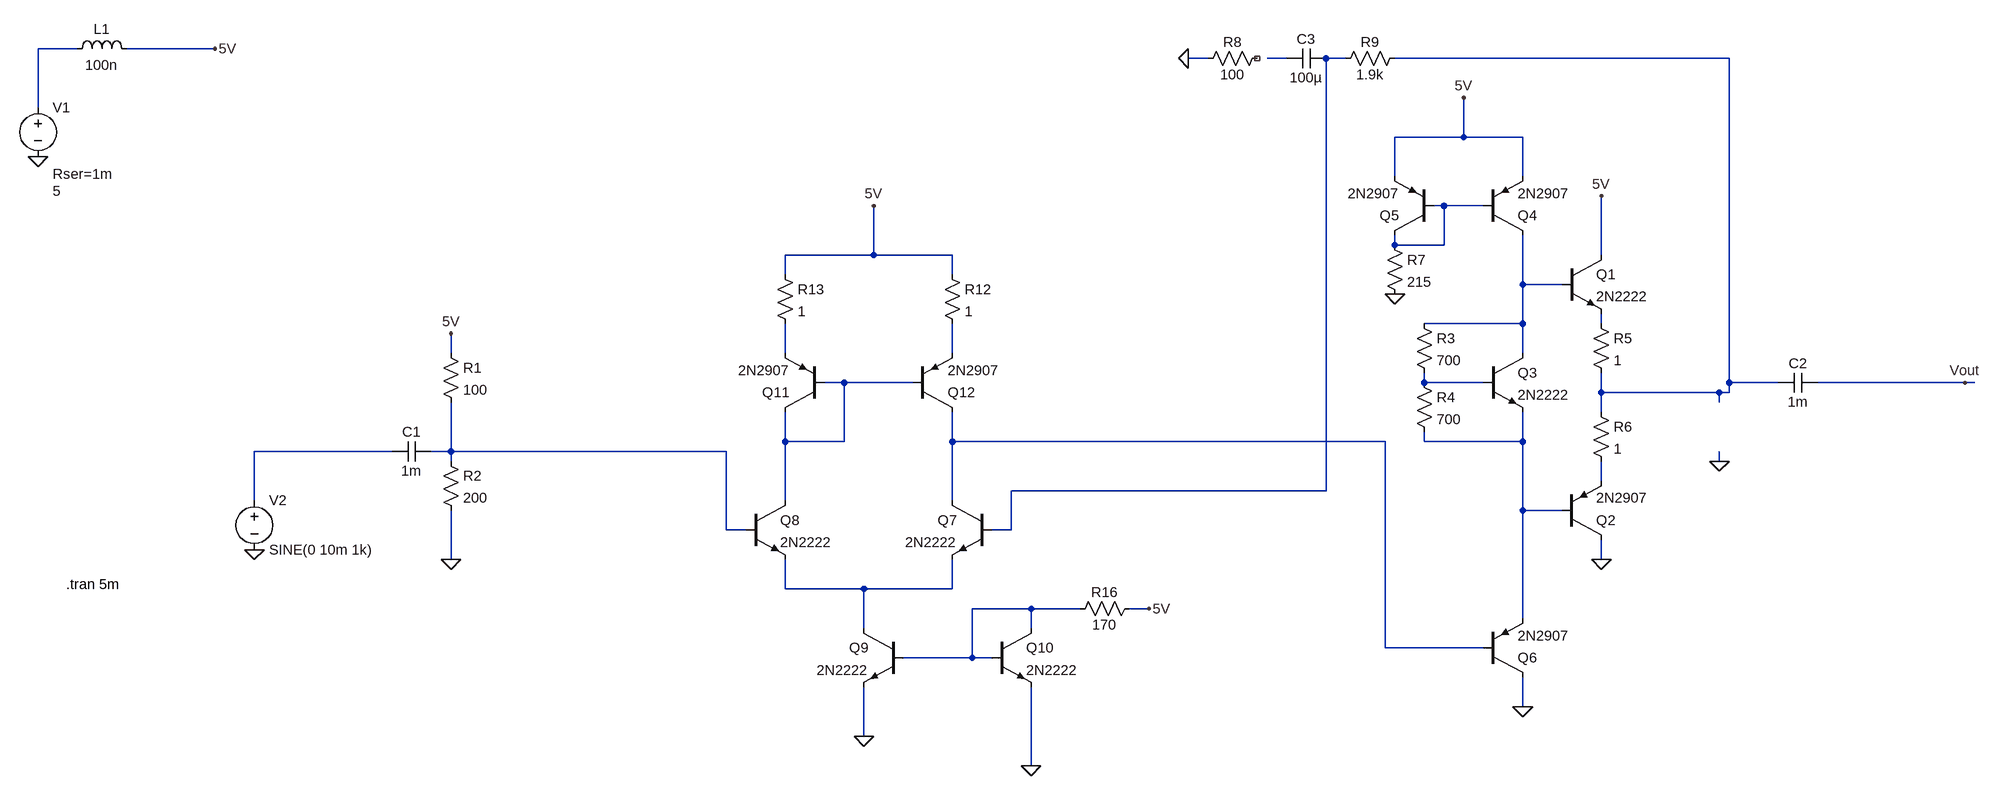
[diagram p0: schematic Draft1.asc]
Draft1.asc, the LTspice schematic file:
Version 4
SHEET 1 1900 756
WIRE -1216 -432 -1280 -432
WIRE -992 -432 -1136 -432
WIRE 624 -416 592 -416
WIRE 752 -416 720 -416
WIRE 848 -416 816 -416
WIRE 1472 -416 928 -416
WIRE -1280 -336 -1280 -432
WIRE 1040 -288 1040 -352
WIRE 1040 -288 928 -288
WIRE 1136 -288 1040 -288
WIRE 928 -224 928 -288
WIRE 1136 -224 1136 -288
WIRE 1008 -176 992 -176
WIRE 1072 -176 1008 -176
WIRE 928 -112 928 -128
WIRE 1008 -112 1008 -176
WIRE 1008 -112 928 -112
WIRE 80 -96 80 -176
WIRE 80 -96 -64 -96
WIRE 208 -96 80 -96
WIRE 1264 -96 1264 -192
WIRE -64 -64 -64 -96
WIRE 208 -64 208 -96
WIRE 1136 -48 1136 -128
WIRE 1200 -48 1136 -48
WIRE 1136 16 1136 -48
WIRE 1136 16 976 16
WIRE 1264 16 1264 0
WIRE -608 64 -608 32
WIRE -64 64 -64 16
WIRE 208 64 208 16
WIRE 1136 64 1136 16
WIRE 32 112 0 112
WIRE 144 112 32 112
WIRE 976 112 976 96
WIRE 1072 112 976 112
WIRE 1472 112 1472 -416
WIRE 1552 112 1472 112
WIRE 1856 112 1616 112
WIRE 1872 112 1856 112
WIRE 1264 128 1264 96
WIRE 1456 128 1264 128
WIRE 1472 128 1472 112
WIRE 1472 128 1456 128
WIRE 1456 144 1456 128
WIRE 1264 160 1264 128
WIRE -64 208 -64 160
WIRE 32 208 32 112
WIRE 32 208 -64 208
WIRE 208 208 208 160
WIRE 912 208 208 208
WIRE 976 208 976 192
WIRE 1136 208 1136 160
WIRE 1136 208 976 208
WIRE -704 224 -928 224
WIRE -608 224 -608 144
WIRE -608 224 -640 224
WIRE -160 224 -608 224
WIRE -608 240 -608 224
WIRE 1456 240 1456 224
WIRE 1264 272 1264 240
WIRE 816 288 816 -416
WIRE 816 288 304 288
WIRE -928 304 -928 224
WIRE -64 304 -64 208
WIRE 208 304 208 208
WIRE 1136 320 1136 208
WIRE 1200 320 1136 320
WIRE -160 352 -160 224
WIRE -128 352 -160 352
WIRE 304 352 304 288
WIRE 304 352 272 352
WIRE -608 400 -608 320
WIRE 1264 400 1264 368
WIRE -64 448 -64 400
WIRE 64 448 -64 448
WIRE 208 448 208 400
WIRE 208 448 64 448
WIRE 336 480 240 480
WIRE 416 480 336 480
WIRE 528 480 496 480
WIRE 1136 496 1136 320
WIRE 64 512 64 448
WIRE 336 512 336 480
WIRE 912 544 912 208
WIRE 1072 544 912 544
WIRE 240 560 240 480
WIRE 240 560 128 560
WIRE 272 560 240 560
WIRE 1136 640 1136 592
WIRE 64 688 64 608
WIRE 336 736 336 608
FLAG -1280 -256 0
FLAG -992 -432 5V
FLAG -928 384 0
FLAG -608 400 0
FLAG -608 32 5V
FLAG 1264 400 0
FLAG 928 -32 0
FLAG 1856 112 Vout
FLAG 1040 -352 5V
FLAG 1264 -192 5V
FLAG 592 -416 0
FLAG 1456 240 0
FLAG 528 480 5V
FLAG 336 736 0
FLAG 64 688 0
FLAG 80 -176 5V
FLAG 1136 640 0
SYMBOL voltage -1280 -352 R0
WINDOW 3 24 152 Left 2
WINDOW 123 0 0 Left 0
WINDOW 39 24 124 Left 2
SYMATTR InstName V1
SYMATTR Value 5
SYMATTR SpiceLine Rser=1m
SYMBOL voltage -928 288 R0
WINDOW 123 0 0 Left 0
WINDOW 39 0 0 Left 0
SYMATTR InstName V2
SYMATTR Value SINE(0 10m 1k)
SYMBOL res -624 48 R0
SYMATTR InstName R1
SYMATTR Value 100
SYMBOL res -624 224 R0
SYMATTR InstName R2
SYMATTR Value 200
SYMBOL cap -640 208 R90
WINDOW 0 0 32 VBottom 2
WINDOW 3 32 32 VTop 2
SYMATTR InstName C1
SYMATTR Value 1m
SYMBOL ind -1232 -416 R270
WINDOW 0 32 56 VTop 2
WINDOW 3 5 56 VBottom 2
SYMATTR InstName L1
SYMATTR Value 100n
SYMBOL npn 1200 -96 R0
SYMATTR InstName Q1
SYMATTR Value 2N2222
SYMBOL pnp 1200 368 M180
SYMATTR InstName Q2
SYMATTR Value 2N2907
SYMBOL npn 1072 64 R0
SYMATTR InstName Q3
SYMATTR Value 2N2222
SYMBOL res 960 0 R0
SYMATTR InstName R3
SYMATTR Value 700
SYMBOL res 960 96 R0
SYMATTR InstName R4
SYMATTR Value 700
SYMBOL res 1248 0 R0
SYMATTR InstName R5
SYMATTR Value 1
SYMBOL res 1248 144 R0
SYMATTR InstName R6
SYMATTR Value 1
SYMBOL pnp 1072 -128 M180
SYMATTR InstName Q4
SYMATTR Value 2N2907
SYMBOL pnp 992 -128 R180
SYMATTR InstName Q5
SYMATTR Value 2N2907
SYMBOL res 912 -128 R0
SYMATTR InstName R7
SYMATTR Value 215
SYMBOL cap 1616 96 R90
WINDOW 0 0 32 VBottom 2
WINDOW 3 32 32 VTop 2
SYMATTR InstName C2
SYMATTR Value 1m
SYMBOL res 720 -432 R90
WINDOW 0 5 56 VBottom 2
WINDOW 3 27 56 VTop 2
SYMATTR InstName R8
SYMATTR Value 100
SYMBOL res 944 -432 R90
WINDOW 0 5 56 VBottom 2
WINDOW 3 27 56 VTop 2
SYMATTR InstName R9
SYMATTR Value 1.9k
SYMBOL cap 816 -432 R90
WINDOW 0 0 32 VBottom 2
WINDOW 3 32 32 VTop 2
SYMATTR InstName C3
SYMATTR Value 100µ
SYMBOL npn -128 304 R0
SYMATTR InstName Q8
SYMATTR Value 2N2222
SYMBOL npn 128 512 M0
SYMATTR InstName Q9
SYMATTR Value 2N2222
SYMBOL npn 272 512 R0
SYMATTR InstName Q10
SYMATTR Value 2N2222
SYMBOL pnp 0 160 R180
SYMATTR InstName Q11
SYMATTR Value 2N2907
SYMBOL pnp 144 160 M180
SYMATTR InstName Q12
SYMATTR Value 2N2907
SYMBOL res 192 -80 R0
SYMATTR InstName R12
SYMATTR Value 1
SYMBOL res -80 -80 R0
SYMATTR InstName R13
SYMATTR Value 1
SYMBOL res 512 464 R90
WINDOW 0 5 56 VBottom 2
WINDOW 3 27 56 VTop 2
SYMATTR InstName R16
SYMATTR Value 170
SYMBOL npn 272 304 M0
SYMATTR InstName Q7
SYMATTR Value 2N2222
SYMBOL pnp 1072 592 M180
SYMATTR InstName Q6
SYMATTR Value 2N2907
TEXT -1234 440 Left 2 !.tran 5m

The netlist it stands for:
* Draft1.asc
V1 N001 0 5 Rser=1m
V2 N014 0 SINE(0 10m 1k)
R1 5V N015 100
R2 N015 0 200
C1 N015 N014 1m
L1 N001 5V 100n
Q1 5V N006 N007 0 2N2222
Q2 0 N013 N016 0 2N2907
Q3 N006 N011 N013 0 2N2222
R3 N006 N011 700
R4 N011 N013 700
R5 N007 N004 1
R6 N004 N016 1
Q4 N006 N005 5V 0 2N2907
Q5 N005 N005 5V 0 2N2907
R7 N005 0 215
C2 Vout N004 1m
R8 NC_01 0 100
R9 N004 N003 1.9k
C3 N003 N002 100µ
Q8 N010 N015 N017 0 2N2222
Q9 N017 N018 0 0 2N2222
Q10 N018 N018 0 0 2N2222
Q11 N010 N010 N008 0 2N2907
Q12 N012 N010 N009 0 2N2907
R12 5V N009 1
R13 5V N008 1
R16 5V N018 170
Q7 N012 N003 N017 0 2N2222
Q6 0 N012 N013 0 2N2907
.model NPN NPN
.model PNP PNP
.lib standard.bjt
.tran 5m
.backanno
.end